# EAGLE design Quasar_Control_Board_v0.1 (EAGLE 8.7.1)
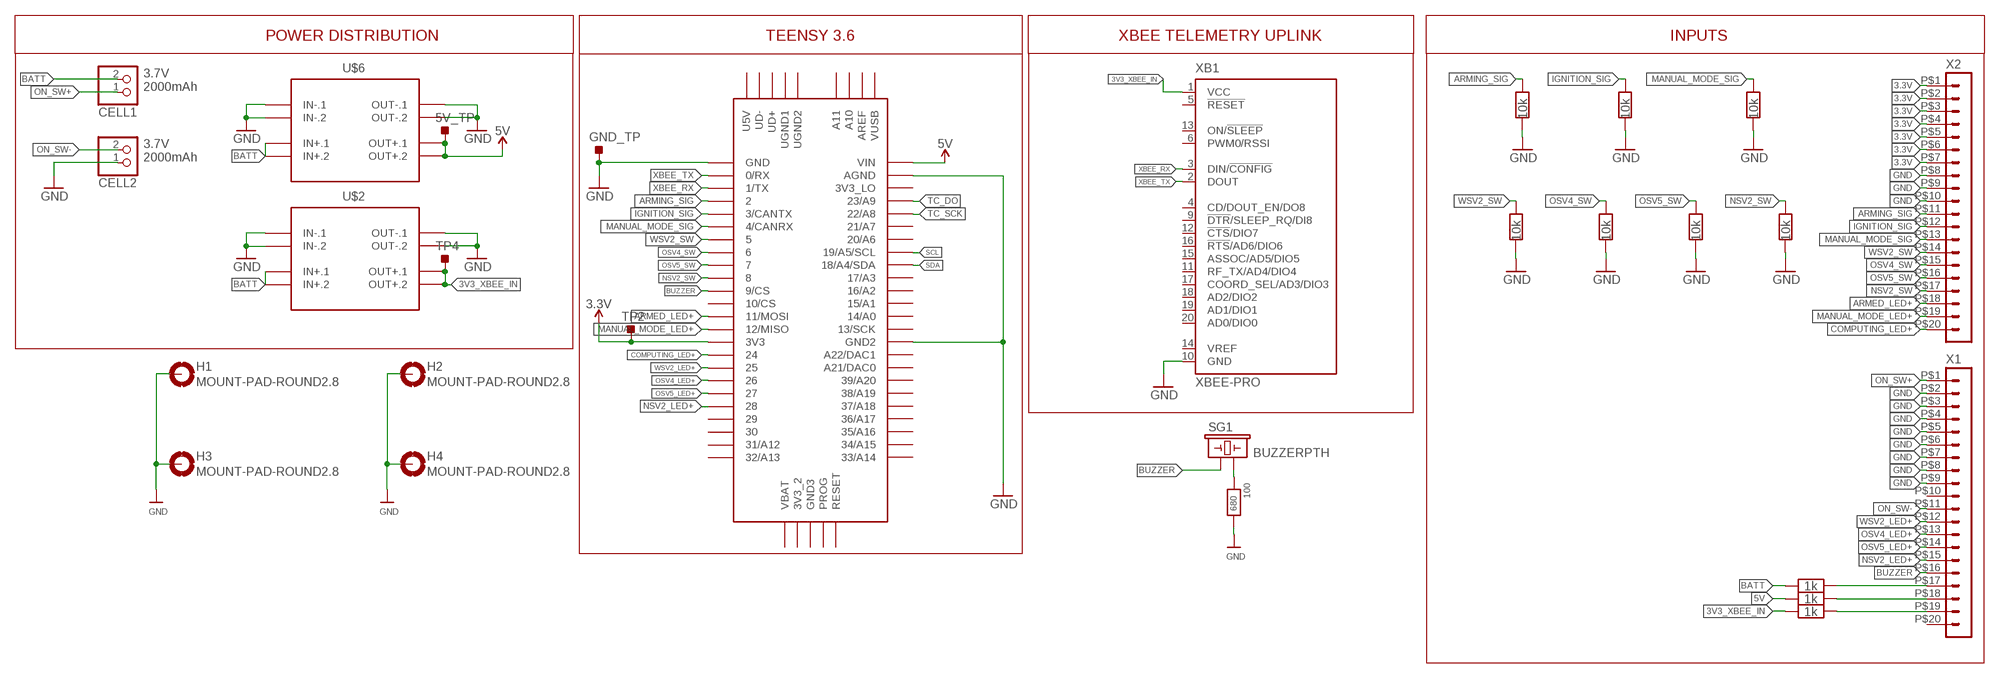
[diagram p0: schematic, sheet 1]

## Parts
5V_TP  TESTPOINT_TPS-SMD-10SN  [TESTPOINT_SMD-10SN]
100  680  RESISTOR0603  [0603]
CELL1  JSTPH  JST_2PIN  [JSTPH2]
CELL2  JSTPH  JST_2PIN  [JSTPH2]
GND_TP  TESTPOINT_TPS-SMD-10SN  [TESTPOINT_SMD-10SN]
H1  MOUNT-PAD-ROUND2.8  [2,8-PAD]
H2  MOUNT-PAD-ROUND2.8  [2,8-PAD]
H3  MOUNT-PAD-ROUND2.8  [2,8-PAD]
H4  MOUNT-PAD-ROUND2.8  [2,8-PAD]
R1  10k  RESISTOR0805  [0805]
R2  10k  RESISTOR0805  [0805]
R3  10k  RESISTOR0805  [0805]
R4  10k  RESISTOR0805  [0805]
R5  10k  RESISTOR0805  [0805]
R6  10k  RESISTOR0805  [0805]
R7  10k  RESISTOR0805  [0805]
R8  1k  RESISTOR0805  [0805]
R9  1k  RESISTOR0805  [0805]
R10  1k  RESISTOR0805  [0805]
SG1  BUZZERPTH  [BUZZER-12MM]
TP2  TESTPOINT_TPS-SMD-10SN  [TESTPOINT_SMD-10SN]
TP4  TESTPOINT_TPS-SMD-10SN  [TESTPOINT_SMD-10SN]
U$1  TEENSY_3.5/3.6  [TEENSY_3.5/3.6]
U$2  12V_LC_REG  DC-DC-STEP-DOWN-MP1584  [DC-DC-STEP-DOWN-MP1584]
U$6  12V_LC_REG  DC-DC-STEP-DOWN-MP1584  [DC-DC-STEP-DOWN-MP1584]
X1  HEADER_POS20_44914-2001  [44914-2001]
X2  HEADER_POS20_44914-2001  [44914-2001]
XB1  XBEE-PRO  [XBEE-PRO]

## Nets
3.3V: TP2.TP U$1.3V3 X2.P$1 X2.P$2 X2.P$3 X2.P$4 X2.P$5 X2.P$6 X2.P$7
3V3_XBEE_IN: R10.2 TP4.TP U$2.OUT+.1 U$2.OUT+.2 XB1.1(VCC)
5V: 5V_TP.TP R9.2 U$1.VIN U$6.OUT+.1 U$6.OUT+.2
ARMED_LED+: U$1.11/MOSI X2.P$18
ARMING_SIG: R1.1 U$1.2 X2.P$11
BATT: CELL1.2 R8.2 U$2.IN+.1 U$2.IN+.2 U$6.IN+.1 U$6.IN+.2
BUZZER: SG1.+ U$1.9/CS X1.P$16
COMPUTING_LED+: U$1.24 X2.P$20
GND: 100.2 CELL2.1 GND_TP.TP H1.B2,8(MOUNT) H2.B2,8(MOUNT) H3.B2,8(MOUNT) H4.B2,8(MOUNT) R1.2 R2.2 R3.2 R4.2 R5.2 R6.2 R7.2 U$1.AGND U$1.GND U$1.GND2 U$2.IN-.1 U$2.IN-.2 U$2.OUT-.1 U$2.OUT-.2 U$6.IN-.1 U$6.IN-.2 U$6.OUT-.1 U$6.OUT-.2 X1.P$2 X1.P$3 X1.P$4 X1.P$5 X1.P$6 X1.P$7 X1.P$8 X1.P$9 X2.P$8 X2.P$9 X2.P$10 XB1.10(GND)
IGNITION_SIG: R2.1 U$1.3/CANTX X2.P$12
MANUAL_MODE_LED+: U$1.12/MISO X2.P$19
MANUAL_MODE_SIG: R3.1 U$1.4/CANRX X2.P$13
N$1: R8.1 X1.P$17
N$2: R9.1 X1.P$18
N$3: R10.1 X1.P$19
N$42: 100.1 SG1.-
NSV2_LED+: U$1.28 X1.P$15
NSV2_SW: R7.1 U$1.8 X2.P$17
ON_SW+: CELL1.1 X1.P$1
ON_SW-: CELL2.2 X1.P$11
OSV4_LED+: U$1.26 X1.P$13
OSV4_SW: R5.1 U$1.6 X2.P$15
OSV5_LED+: U$1.27 X1.P$14
OSV5_SW: R6.1 U$1.7 X2.P$16
SCL: U$1.19/A5/SCL
SDA: U$1.18/A4/SDA
TC_DO: U$1.23/A9
TC_SCK: U$1.22/A8
WSV2_LED+: U$1.25 X1.P$12
WSV2_SW: R4.1 U$1.5 X2.P$14
XBEE_RX: U$1.1/TX XB1.3(DIN/!CONFIG)
XBEE_TX: U$1.0/RX XB1.2(DOUT)
Unconnected: U$1.3V3_2 U$1.3V3_LO U$1.10/CS U$1.13/SCK U$1.14/A0 U$1.15/A1 U$1.16/A2 U$1.17/A3 U$1.20/A6 U$1.21/A7 U$1.21/DAC0(A21/DAC0) U$1.29 U$1.30 U$1.31/A12 U$1.32/A13 U$1.33/A14 U$1.34/A15 U$1.35/A16 U$1.36/A17 U$1.37/A18 U$1.38/A19 U$1.39/A20 U$1.A10 U$1.A11 U$1.A22/DAC1 U$1.AREF U$1.GND3 U$1.PROG U$1.RESET U$1.U5V U$1.UD+ U$1.UD- U$1.UGND1 U$1.UGND2 U$1.VBAT U$1.VUSB X1.P$10 X1.P$20 XB1.4(CD/DOUT_EN/DO8) XB1.5(!RESET) XB1.6(PWM0/RSSI) XB1.9(!DTR!/SLEEP_RQ/DI8) XB1.11(RF_TX/AD4/DIO4) XB1.12(!CTS!/DIO7) XB1.13(ON/!SLEEP) XB1.14(VREF) XB1.15(ASSOC/AD5/DIO5) XB1.16(!RTS!/AD6/DIO6) XB1.17(COORD_SEL/AD3/DIO3) XB1.18(AD2/DIO2) XB1.19(AD1/DIO1) XB1.20(AD0/DIO0)

## Notes on the sheet
- POWER DISTRIBUTION | TEENSY 3.6 | XBEE TELEMETRY UPLINK | INPUTS
- 3.7V
  2000mAh
- 3.7V
  2000mAh

## Library data of the parts
5V_TP GND_TP TP2 TP4 = 52101-101-REV-A:TESTPOINT_TPS: TEST POINT PAD; BOM: EXCLUDE
100 R1-R10 = microbuilder:RESISTOR: Resistors 0402 - 0402 Surface Mount Package 22 Ohm 1% 1/16W [Digikey: 311-22.0LRTR-ND] 33 Ohm 5% 1/16W 1.0K 5% 1/16W 1.5K 5% 1/16W 2.0K 1% 1/16W 10.0K 1% 1/16W [Digikey: 311-10.0KLRTR-ND] 10.0K 5% 1/16W [Digikey: RMCF0402JT10K0TR-ND] 12.1K 1% 1/16W [Digikey: 311-22.0LRTR-ND] 100.0K 5% 1/16W 0603 - 0603 Surface Mount Package 0 Ohm 1/10 Watt 1% Resistor 15 Ohm 1/10 Watt 1% Resistor 33 Ohm 1/10 Watt 1% Resistor 49.9 Ohm 1/10 Watt 1% Resistor 100 Ohm 1/10 Watt 1% Resistor 150 Ohm 1/10 Watt 1% Resistor 240 Ohm 1/10 Watt 1% Resistor 390 Ohm 1/10 Watt 1% Resistor 560 Ohm 1/10 Watt 1% Resistor 680 Ohm 1/10 Watt 1% Resistor 750 Ohm 1/10 Watt 1% Resistor 1.0K Ohm 1/10 Watt 1% Resistor 1.5K Ohm 1/10 Watt 1% Resistor 2.0K Ohm 1/10 Watt 1% Resistor 2.2K Ohm 1/10 Watt 1% Resistor 3.3K Ohm 1/10 Watt 1% Resistor 4.7K Ohm 1/10 Watt 1% Resistor 10.0K Ohm 1/10 Watt 1% Resistor 12.0K Ohm 1/10 Watt 1% Resistor 12.1K Ohm 1/10 Watt 1% Resistor 20.0K Ohm 1/10 Watt 1% Resistor 33.0K Ohm 1/10 Watt 1% Resistor 100.0K Ohm 1/10 Watt 1% Resistor 0805 - 0805 Surface Mount Package 0 Ohm 1/8 Watt 1% Resistor 33 Ohm 1/8 Watt 1% Resistor 100 Ohm 1/8 Watt 1% Resistor 150 Ohm 1/8 Watt 1% Resistor 200 Ohm 1/8 Watt 1% Resistor 240 Ohm 1/8 Watt 1% Resistor 330 Ohm 1/8 Watt 1% Resistor 390 Ohm 1/8 Watt 1% Resistor 470 Ohm 1/8 Watt 1% Resistor 1.0K Ohm 1/8 Watt 1% Resistor 1.5K Ohm 1/8 Watt 1% Resistor 2.0K Ohm 1/8 Watt 1% Resistor 4.7K Ohm 1/8 Watt 1% Resistor 5.1K Ohm 1/8 Watt 1% Resistor 5.6K Ohm 1/8 Watt 1% Resistor 10.0K Ohm 1/8 Watt 1% Resistor 22.0K Ohm 1/8 Watt 1% Resistor 33.0K Ohm 1/8 Watt 1% Resistor 100K Ohm 1/8 Watt 1% Resistor 1206 - 1206 Surface Mount Package 2012 - 2010 Surface Mount Package 0.11 Ohm 1/2 Watt 1% Resistor - Digikey: RHM.11UCT-ND
CELL1 CELL2 = microbuilder:JST_2PIN: JST 2-Pin Right-Angle Connector PH-Series - 4UConnector: 17311 SH-Series - 4UConnector: 07278
H1-H4 = holes:MOUNT-PAD-ROUND: MOUNTING PAD, round
SG1 = SparkFun:BUZZER: Buzzer 12mm Spark Fun Electronics SKU : Comp-Buzzer
U$1 = Teensy356:TEENSY_3.5/3.6
U$2 U$6 = diy-modules:DC-DC-STEP-DOWN-MP1584: DC/DC Step-Down Regulator based on MP1584 chip MP1584 datasheet available here: http://www.haoyuelectronics.com/Attachment/MP1584/MP1584.pdf Click here to find device on ebay.com <http://www.ebay.com/sch/mp1584+module>
X1 X2 = con-molex-micro-fit-3_0:HEADER_POS20_?: Molex - Micro-Fit 3.0 Series connector, 3.00mm (0.118") pitch header, 20 positions.
XB1 = maxstream:XBEE: XBee (TM) /XBee-PRO(TM) OEM RF Modules Source: MaxStream, Inc. xbee_productmanual.pdf; MPN: XBP24-AWI-001; OC_FARNELL: 1337916; OC_NEWARK: 42M2667

## Board
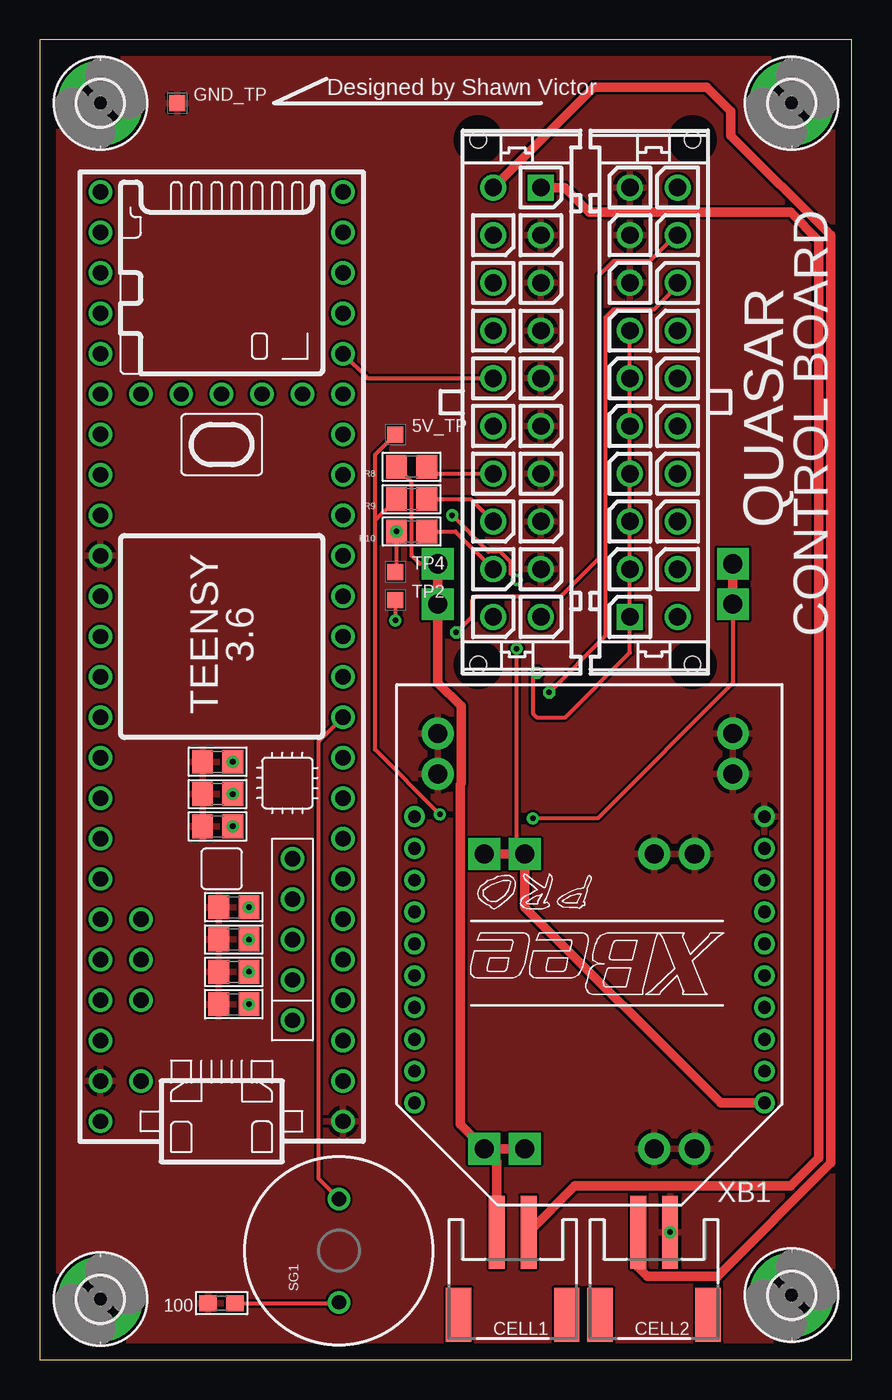
[diagram p1: board, top side]
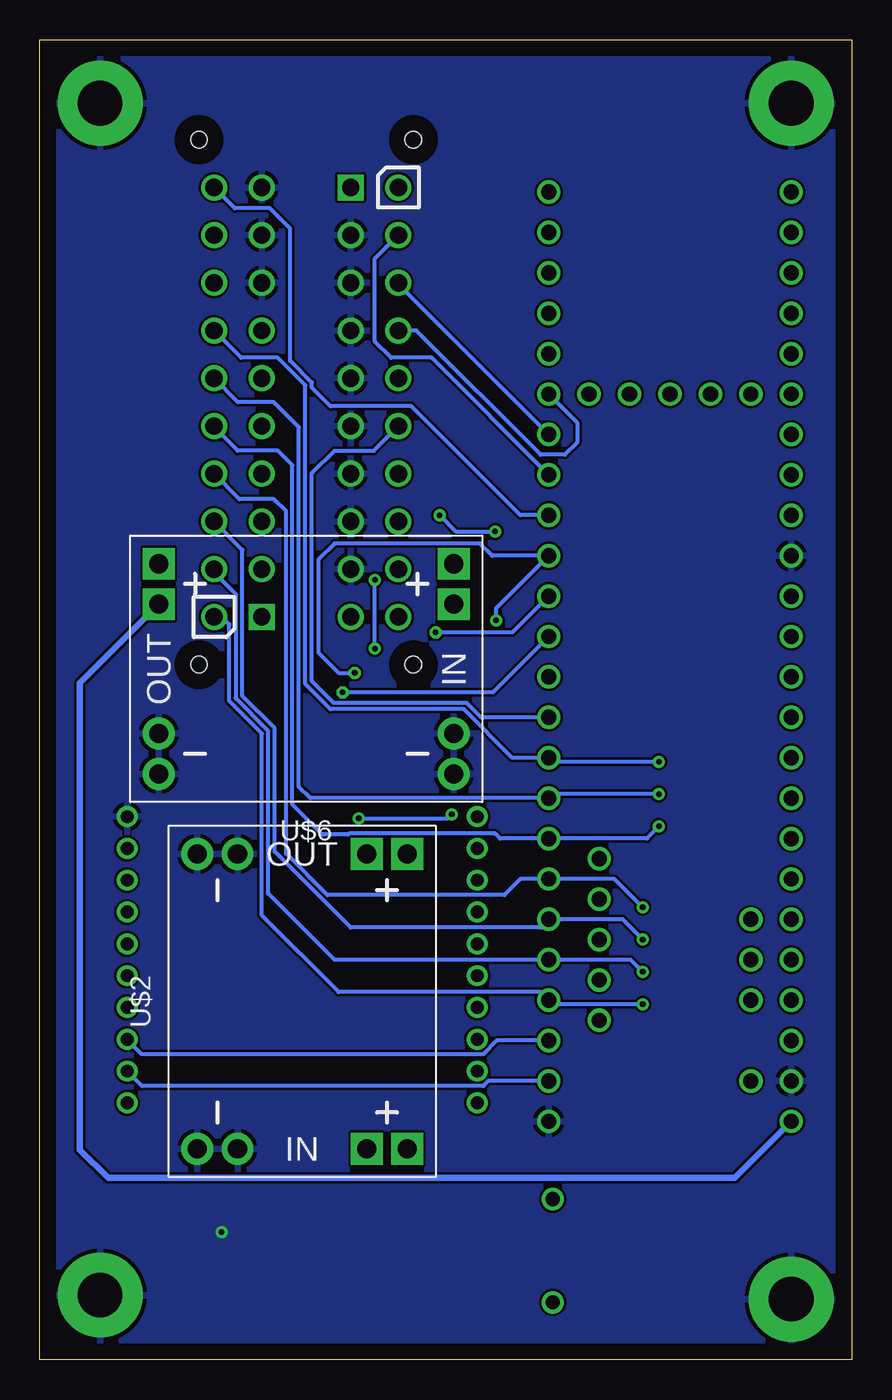
[diagram p2: board, bottom side, seen from below]

Size 51.03 x 82.98 mm. Coordinates in mm from the lower left corner, seen from the top.
Outline: 0,0 51.03,0 51.03,82.98 0,82.98 0,0
Copper layers (1*16): Top 0.035mm / dielectric 1.5mm / Bottom 0.035mm
Design rules "default": minimum track width 6mil, minimum drill 0.35mm, track to track 6mil, track to pad 6mil, pad to pad 6mil, via to via 6mil, smd to smd 6mil, copper to edge 40mil, drill to drill 6mil, minimum pad ring 10mil, minimum via ring 8mil, stop-mask expansion 4mil, vias tented up to drill 0mil, thermal gap 10mil

### Footprints (pad centres in the part's own frame; a part is rotated, then mirrored left to right if it is on the bottom)
TESTPOINT_SMD-10SN = smd 1 x 1: TP 0,0
0603 = smd 1.1 x 1: 1 -0.85,0; 2 0.85,0
JSTPH2 = smd 1 x 4.6: 1 -1,-3.7; 2 1,-3.7 | smd 1.6 x 3.4: NC1 -3.4,1.5; NC2 3.4,1.5
2,8-PAD = drill 2.8 pad 5.334: B2,8 0,0
0805 = smd 1.3 x 1.5: 1 -0.95,0; 2 0.95,0
BUZZER-12MM = drill 0.9: + 3.25,0; - -3.25,0
TEENSY_3.5/3.6 = drill 0.965: 0/RX -25.4,-7.62; 1/TX -22.86,-7.62; 2 -20.32,-7.62; 3/CANTX -17.78,-7.62; 3V3 7.62,-7.62; 3V3_2 17.78,-2.54; 3V3_LO -22.86,7.62; 4/CANRX -15.24,-7.62; 5 -12.7,-7.62; 6 -10.16,-7.62; 7 -7.62,-7.62; 8 -5.08,-7.62; 9/CS -2.54,-7.62; 10/CS 0,-7.62; 11/MOSI 2.54,-7.62; 12/MISO 5.08,-7.62; 13/SCK 5.08,7.62; 14/A0 2.54,7.62; 15/A1 0,7.62; 16/A2 -2.54,7.62; 17/A3 -5.08,7.62; 18/A4/SDA -7.62,7.62; 19/A5/SCL -10.16,7.62; 20/A6 -12.7,7.62; 21/A7 -15.24,7.62; 21/DAC0 12.7,7.62; 22/A8 -17.78,7.62; 23/A9 -20.32,7.62; 24 10.16,-7.62; 25 12.7,-7.62; 26 15.24,-7.62; 27 17.78,-7.62; 28 20.32,-7.62; 29 22.86,-7.62; 30 25.4,-7.62; 31/A12 27.94,-7.62; 32/A13 30.48,-7.62; 33/A14 30.48,7.62; 34/A15 27.94,7.62; 35/A16 25.4,7.62; 36/A17 22.86,7.62; 37/A18 20.32,7.62; 38/A19 17.78,7.62; 39/A20 15.24,7.62; A10 -17.78,5.08; A11 -15.24,5.08; A22/DAC1 10.16,7.62; AGND -25.4,7.62; AREF -20.32,5.08; GND -27.94,-7.62; GND2 7.62,7.62; GND3 17.78,0; PROG 17.78,2.54; RESET 17.78,5.08; U5V -21.59,-4.445; UD+ -16.51,-4.445; UD- -19.05,-4.445; UGND1 -13.97,-4.445; UGND2 -11.43,-4.445; VBAT 17.78,-5.08; VIN -27.94,7.62; VUSB -25.4,5.08
DC-DC-STEP-DOWN-MP1584 = drill 1.2 pad 2 square: IN+.1 -9.271,-4.064; IN+.2 -9.271,-6.604; OUT+.1 9.271,-4.064; OUT+.2 9.271,-6.604 | drill 1.2 pad 2: IN-.1 -9.271,6.604; IN-.2 -9.271,4.064; OUT-.1 9.271,6.604; OUT-.2 9.271,4.064
44914-2001 = drill 1.09 square: P$1 13.5,0 | drill 1.09: P$2 10.5,0; P$3 7.5,0; P$4 4.5,0; P$5 1.5,0; P$6 -1.5,0; P$7 -4.5,0; P$8 -7.5,0; P$9 -10.5,0; P$10 -13.5,0; P$11 13.5,3; P$12 10.5,3; P$13 7.5,3; P$14 4.5,3; P$15 1.5,3; P$16 -1.5,3; P$17 -4.5,3; P$18 -7.5,3; P$19 -10.5,3; P$20 -13.5,3 | hole 1.02: 16.5,3.94; -16.5,3.94
XBEE-PRO = drill 0.8 pad 1.27: 1 -11,9; 2 -11,7; 3 -11,5; 4 -11,3; 5 -11,1; 6 -11,-1; 7 -11,-3; 8 -11,-5; 9 -11,-7; 10 -11,-9; 11 11,-9; 12 11,-7; 13 11,-5; 14 11,-3; 15 11,-1; 16 11,1; 17 11,3; 18 11,5; 19 11,7; 20 11,9

### Placement (x,y rotation side)
5V_TP  22.35,58.17 0 top
100  11.43,3.56 180 top
CELL1  29.72,4.32 180 top
CELL2  38.61,4.32 180 top
GND_TP  8.64,78.99 0 top
H1  47.24,78.99 0 top
H2  47.24,4.06 0 top
H3  3.81,3.81 0 top
H4  3.81,78.99 0 top
R1  12.19,22.35 180 top
R2  12.19,24.38 180 top
R3  12.19,26.42 180 top
R4  12.19,28.45 180 top
R5  11.18,33.53 180 top
R6  11.18,35.56 180 top
R7  11.18,37.59 180 top
R8  23.37,56.13 180 top
R9  23.37,54.1 180 top
R10  23.37,52.07 180 top
SG1  18.8,6.86 90 top
TP2  22.35,47.75 0 top
TP4  22.35,49.53 0 top
U$1  11.43,42.93 90 top
U$2  34.54,22.53 90 bottom
U$6  34.29,43.43 180 bottom
X1  31.5,60.2 90 top
X2  37.08,60.2 270 top
XB1  34.54,25.15 180 top

### Tracks (layer width: path | path; a pad name or v marks a point on that pad's centre or on a via)
3.3V  (via drill 0.35)
  Top 0.254: v31.24,43.18 30.99,42.93 30.99,40.64 31.24,40.39 33.02,40.39 37.08,44.45 X2.P$1 X2.P$2 X2.P$3 X2.P$4 X2.P$5 X2.P$6 X2.P$7 | TP2.TP v22.35,46.48
  Bottom 0.254: v31.24,43.18 32.26,43.18 33.53,44.45 33.53,50.29 32.5,51.32 23.38,51.32 22.61,50.55 U$1.3V3 22.35,47.24 v22.35,46.48
3V3_XBEE_IN  (via drill 0.35)
  Top 0.254: U$2.OUT+.1 29.97,32.31 v29.97,44.7 | v29.97,49.02 29.59,49.4 29.59,50.15 28.95,50.8 28.2,50.8 v25.91,53.09 | TP4.TP 22.42,49.6 R10.2
  Top 0.61: U$2.OUT+.2 U$2.OUT+.1 30.48,28.45 42.78,16.15 XB1.1
  Bottom 0.254: v29.97,44.7 v29.97,49.02 | v25.91,53.09 24.89,52.07 R10.2
  other vias: 22.42,52.07
5V  (via drill 0.35)
  Top 0.254: U$6.OUT+.1 43.56,42.55 35.05,34.04 v30.99,34.04 | v25.15,34.29 21.08,38.35 21.08,52.78 | R9.2 21.67,53.35 21.65,53.35 21.08,52.78 | 21.08,52.78 21.08,56.9 5V_TP.TP
  Top 0.61: U$6.OUT+.1 U$6.OUT+.2
  Bottom 0.254: v30.99,34.04 25.4,34.04 v25.15,34.29
  Bottom 0.406: U$1.VIN 7.37,11.43 46.74,11.43 48.51,13.21 48.51,42.55 U$6.OUT+.1
ARMED_LED+  (via drill 0.35)
  Top 0.254: v32,41.96 35.56,45.51 35.56,65.53 36.07,66.04 38.61,66.04 40.08,67.52 X2.P$18
  Bottom 0.254: U$1.11/MOSI 22.56,41.96 v32,41.96
ARMING_SIG  (via drill 0.35)
  Bottom 0.254: X2.P$11 39.59,46.7 39.12,46.23 39.12,41.4 37.08,39.37 37.08,27.94 32.26,23.11 19.56,23.11 U$1.2 18.8,22.35 R1.1
  other vias: 13.14,22.35
BATT
  Top 0.254: U$6.IN+.2 23.88,50.04 23.37,50.55 23.37,55.18 R8.2
  Top 0.61: CELL1.2 28.72,12.48 U$2.IN+.2 | U$2.IN+.2 U$2.IN+.1 | U$2.IN+.2 26.42,14.78 26.42,36.17 26.48,36.23 26.48,41.09 25.02,42.55 U$6.IN+.1 U$6.IN+.2
BUZZER
  Top 0.254: SG1.+ 17.53,11.38 17.53,38.86 U$1.9/CS
  Bottom 0.254: U$1.9/CS 23.3,40.39 24.22,41.3 32.56,41.3 33.93,42.67 33.93,55.73 32.51,57.15 30.04,57.15 X1.P$16
COMPUTING_LED+
  Bottom 0.254: U$1.24 20.83,53.09 27.69,59.94 32.77,59.94 33.93,61.11 33.93,61.43 35.31,62.8 35.31,71.12 36.58,72.39 38.78,72.39 X2.P$20
GND  (via drill 0.35)
  other vias: 39.61,8.02
  pour Top: -3.56,-2.54 -3.56,86.11 54.36,86.11 54.36,-2.54
  pour Bottom: -6.6,85.85 -6.6,-3.56 55.88,-3.56 55.88,85.85
IGNITION_SIG  (via drill 0.35)
  Bottom 0.254: 38.7,41.56 36.68,39.54 36.68,29.31 32.51,25.15 U$1.3/CANTX 13.9,25.15 R2.1 | 38.7,41.56 38.71,41.57 38.71,41.66 | 38.7,41.56 38.7,48.1 40.08,49.48 X2.P$12
  other vias: 13.14,24.38
MANUAL_MODE_LED+  (via drill 0.35)
  Top 0.254: v26.16,45.72 27.18,46.74 27.18,47.75 27.43,48.01 32.77,48.01 35.15,50.39 35.15,68.17 36.07,69.09 38.35,69.09 39.96,70.7 X2.P$19
  Bottom 0.254: U$1.12/MISO 21.34,45.72 v26.16,45.72
MANUAL_MODE_SIG  (via drill 0.35)
  Bottom 0.254: X2.P$13 38.3,50.91 38.3,41.73 36.27,39.71 36.27,31.95 31.5,27.18 19.56,27.18 U$1.4/CANRX 14.41,27.69 R3.1
  other vias: 13.14,26.42
N$1
  Top 0.254: R8.1 24.75,55.7 X1.P$17
N$2
  Top 0.254: R9.1 27.09,54.1 X1.P$18
N$3
  Top 0.254: R10.1 26.12,52.07 X1.P$19
N$42
  Top 0.254: 100.1 18.74,3.56 SG1.-
NSV2_LED+
  Top 0.254: U$1.28 20.6,61.7 X1.P$15
NSV2_SW  (via drill 0.35)
  Bottom 0.254: X2.P$17 38.38,62.99 36.07,62.99 34.34,61.27 34.34,42.47 32.77,40.89 24.38,40.89 21.34,37.85 U$1.8 18.8,37.59 R7.1
  other vias: 12.13,37.59
ON_SW+
  Top 0.61: X1.P$1 32.98,73.7 34.54,72.14 47.18,72.14 48.95,70.37 48.95,12.69 47.18,10.92 33.62,10.92 CELL1.1
ON_SW-
  Top 0.61: X1.P$11 34.81,80.01 41.91,80.01 43.43,78.49 43.43,76.96 49.71,70.68 49.71,67.82 49.71,12.38 42.6,5.26 38.17,5.26 37.59,5.84 37.61,5.86 CELL2.2
OSV4_LED+
  Bottom 0.254: U$1.26 28.5,67.61 X1.P$13
OSV4_SW  (via drill 0.35)
  Bottom 0.254: X2.P$15 40.08,58.63 38.61,57.15 36.07,57.15 35.15,56.24 35.15,34.9 33.27,33.02 31.66,33.02 31.6,33.08 22.41,33.08 22.1,32.77 U$1.6 12.89,32.77 R5.1
  other vias: 12.13,33.53
OSV5_LED+
  Bottom 0.254: U$1.27 17.27,58.93 17.27,57.66 18.03,56.9 19.56,56.9 27.36,64.7 X1.P$14
OSV5_SW  (via drill 0.35)
  Bottom 0.254: X2.P$16 38.58,60.2 36.32,60.2 34.75,58.62 34.75,36.02 34.04,35.31 U$1.7 18.8,35.56 R6.1
  other vias: 12.13,35.56
WSV2_LED+
  Bottom 0.254: U$1.25 26.42,62.99 28.96,62.99 29.97,64.01 29.97,69.22 X1.P$12
WSV2_SW  (via drill 0.35)
  Bottom 0.254: X2.P$14 38.49,54.1 36.32,54.1 35.56,53.34 35.56,31.82 32.95,29.21 21.84,29.21 20.83,30.23 U$1.5 14.92,30.23 R4.1
  other vias: 13.14,28.45
XBEE_RX
  Bottom 0.254: U$1.1/TX 22.3,20.07 23.16,19.21 44.61,19.21 XB1.3
XBEE_TX
  Bottom 0.254: U$1.0/RX 22.84,17.53 23.16,17.21 44.61,17.21 XB1.2

### Text on the board
tPlace: Designed by Shawn Victor | QUASAR | CONTROL BOARD